# EAGLE design Gate to Trig Converter V1 (EAGLE 7.7.0)
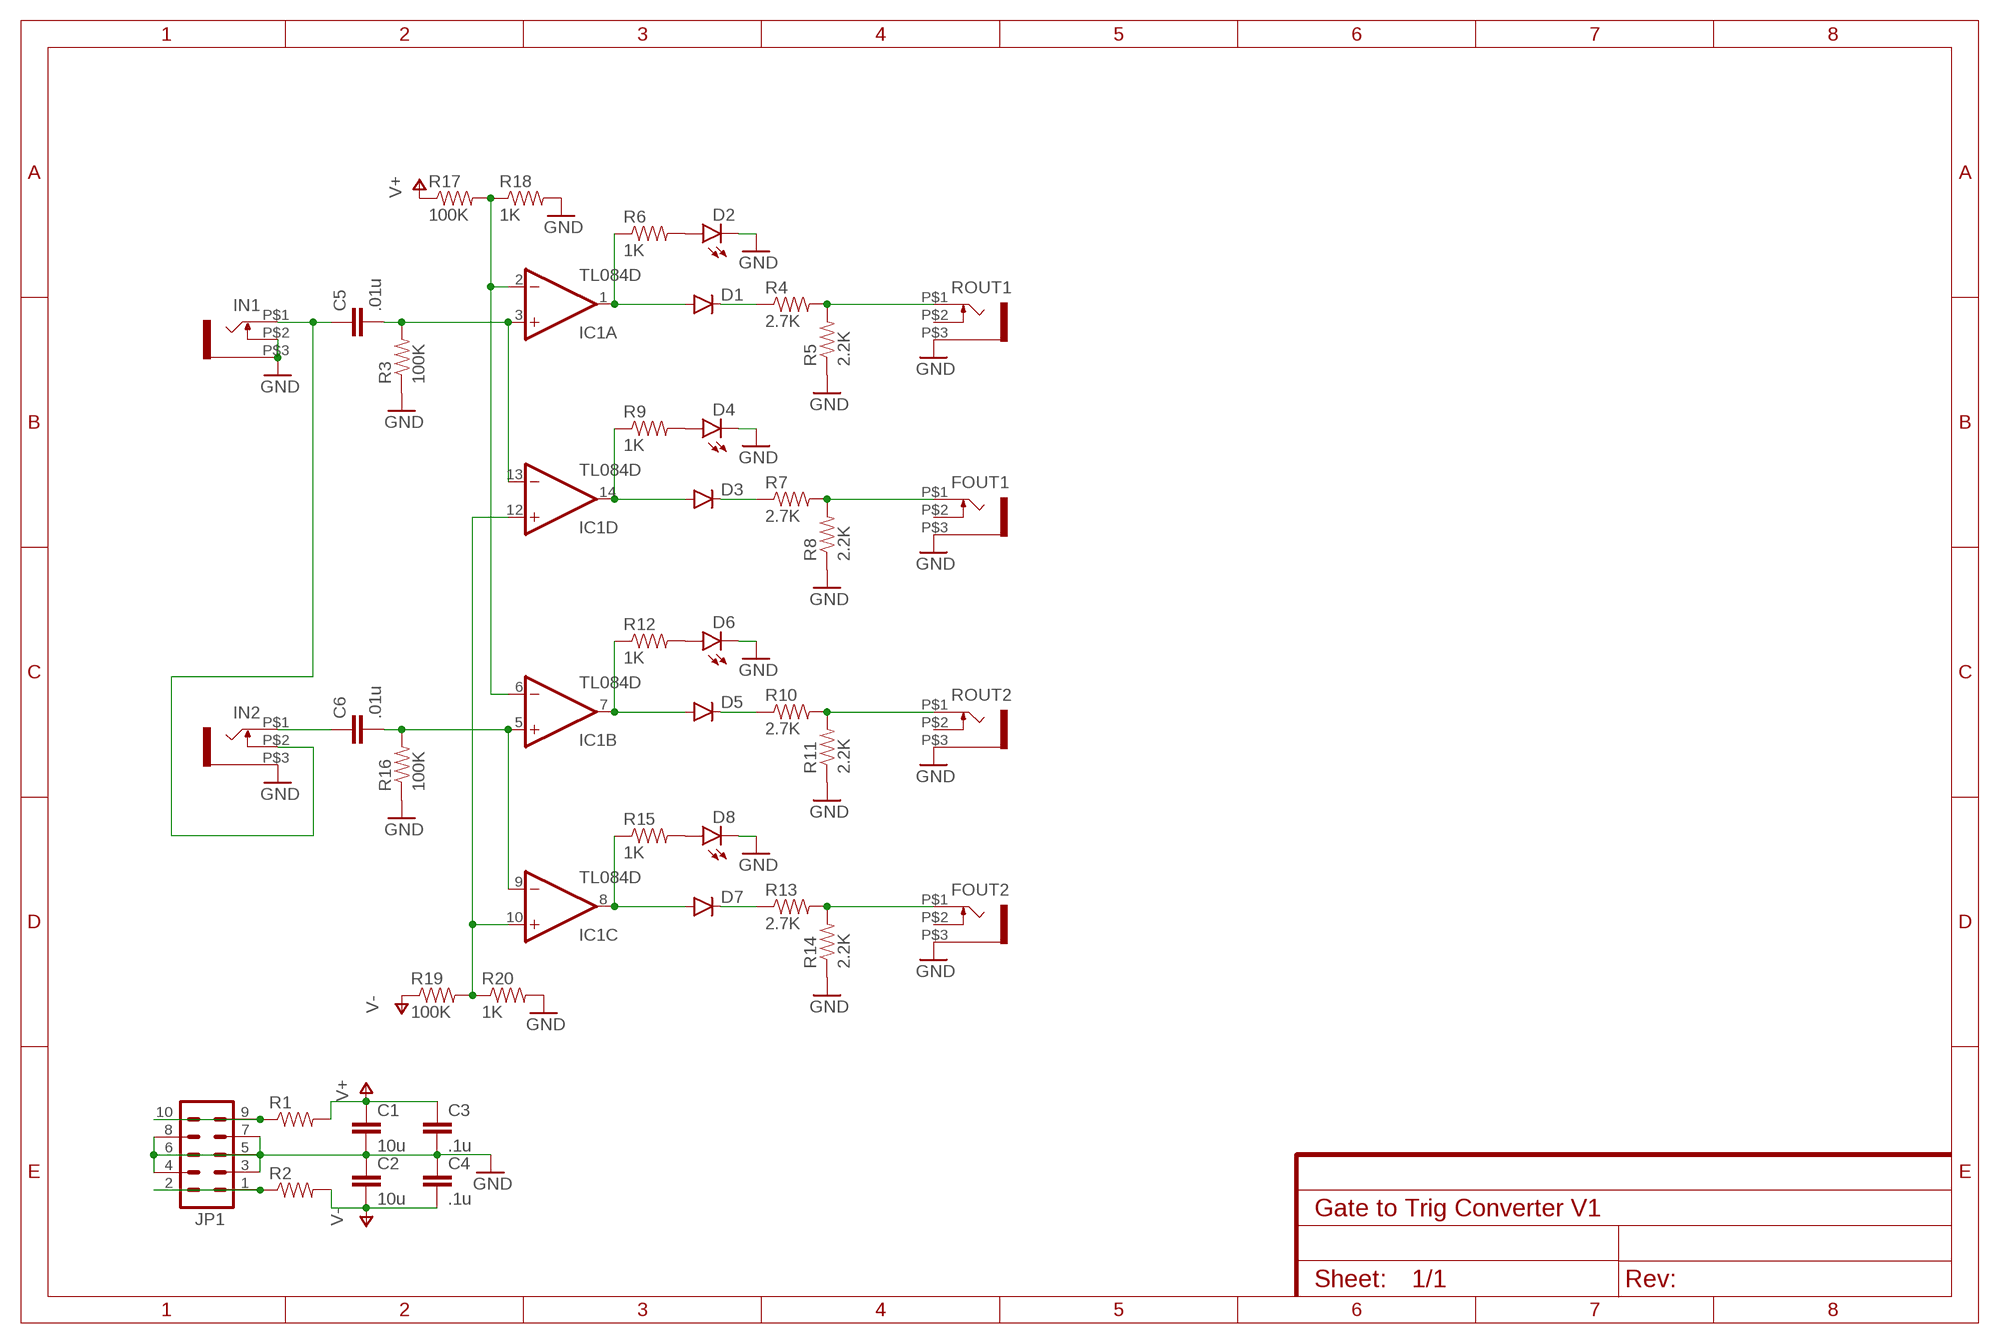
[diagram p0: schematic, sheet 1]

## Parts
C1  10u  CAP1206  [1206]
C2  10u  CAP1206  [1206]
C3  .1u  CAP0805  [0805]
C4  .1u  CAP0805  [0805]
C5  .01u  CAP0805  [0805]
C6  .01u  CAP0805  [0805]
D1  DIODESOD123  [SOD-123]
D2  LED3MM  [LED3MM]
D3  DIODESOD123  [SOD-123]
D4  LED3MM  [LED3MM]
D5  DIODESOD123  [SOD-123]
D6  LED3MM  [LED3MM]
D7  DIODESOD123  [SOD-123]
D8  LED3MM  [LED3MM]
FOUT1  WQP-PJ301M-12_JACK  [WQP-PJ301M-12_JACK]
FOUT2  WQP-PJ301M-12_JACK  [WQP-PJ301M-12_JACK]
IC1  TL084D  [SO14]
IN1  WQP-PJ301M-12_JACK  [WQP-PJ301M-12_JACK]
IN2  WQP-PJ301M-12_JACK  [WQP-PJ301M-12_JACK]
JP1  M05X2PTH  [AVR_ICSP]
R1  RESISTOR0805-RES  [0805]
R2  RESISTOR0805-RES  [0805]
R3  100K  RESISTOR0805-RES  [0805]
R4  2.7K  RESISTOR0805-RES  [0805]
R5  2.2K  RESISTOR0805-RES  [0805]
R6  1K  RESISTOR0805-RES  [0805]
R7  2.7K  RESISTOR0805-RES  [0805]
R8  2.2K  RESISTOR0805-RES  [0805]
R9  1K  RESISTOR0805-RES  [0805]
R10  2.7K  RESISTOR0805-RES  [0805]
R11  2.2K  RESISTOR0805-RES  [0805]
R12  1K  RESISTOR0805-RES  [0805]
R13  2.7K  RESISTOR0805-RES  [0805]
R14  2.2K  RESISTOR0805-RES  [0805]
R15  1K  RESISTOR0805-RES  [0805]
R16  100K  RESISTOR0805-RES  [0805]
R17  100K  RESISTOR0805-RES  [0805]
R18  1K  RESISTOR0805-RES  [0805]
R19  100K  RESISTOR0805-RES  [0805]
R20  1K  RESISTOR0805-RES  [0805]
ROUT1  WQP-PJ301M-12_JACK  [WQP-PJ301M-12_JACK]
ROUT2  WQP-PJ301M-12_JACK  [WQP-PJ301M-12_JACK]

## Nets
GND: C1.2 C2.1 C3.2 C4.1 D2.K(C) D4.K(C) D6.K(C) D8.K(C) FOUT1.P$3 FOUT2.P$3 IN1.P$2 IN1.P$3 IN2.P$3 JP1.3 JP1.4 JP1.5 JP1.6 JP1.7 JP1.8 R3.1 R5.1 R8.1 R11.1 R14.1 R16.1 R18.2 R20.2 ROUT1.P$3 ROUT2.P$3
N$1: JP1.9 JP1.10 R1.1
N$2: JP1.1 JP1.2 R2.1
N$5: R4.2 R5.2 ROUT1.P$1
N$6: D2.A R6.2
N$7: C5.1 IN1.P$1 IN2.P$2
N$8: C5.2 IC1.3(A:+IN) IC1.13(D:-IN) R3.2
N$9: D1.A IC1.1(A:OUT) R6.1
N$10: D1.C R4.1
N$11: FOUT1.P$1 R7.2 R8.2
N$12: D4.A R9.2
N$13: D3.A IC1.14(D:OUT) R9.1
N$14: D3.C R7.1
N$15: R10.2 R11.2 ROUT2.P$1
N$16: D6.A R12.2
N$17: D5.A IC1.7(B:OUT) R12.1
N$18: D5.C R10.1
N$19: FOUT2.P$1 R13.2 R14.2
N$20: D8.A R15.2
N$21: D7.A IC1.8(C:OUT) R15.1
N$22: D7.C R13.1
N$23: C6.1 IN2.P$1
N$24: C6.2 IC1.5(B:+IN) IC1.9(C:-IN) R16.2
N$25: IC1.2(A:-IN) IC1.6(B:-IN) R17.2 R18.1
N$26: IC1.10(C:+IN) IC1.12(D:+IN) R19.2 R20.1
V+: C1.1 C3.1 R1.2 R17.1
V-: C2.2 C4.2 R2.2 R19.1
Unconnected: FOUT1.P$2 FOUT2.P$2 ROUT1.P$2 ROUT2.P$2

## Power pins joined to a net without a drawn wire
V+: IC1.4(P:V+)
V-: IC1.11(P:V-)

## Library data of the parts
C1-C6 = SparkFun-Passives:CAP: Capacitor Standard 0603 ceramic capacitor, and 0.1" leaded capacitor.
D1 D3 D5 D7 = SparkFun-DiscreteSemi:DIODE: Diode These are standard reverse protection diodes and small signal diodes. SMA package can handle up to about 1A. SOD-323 can handle about 200mA. What the SOD-323 package when ordering, there are some mfgs out there that are 5-pin packages.
D2 D4 D6 D8 = SparkFun-LED:LED: LEDs Standard schematic elements and footprints for 5mm, 3mm, 1206, and 0603 sized LEDs. 5mm - Spark Fun Electronics SKU : COM-00529 (and others)
FOUT1 FOUT2 IN1 IN2 ROUT1 ROUT2 = thonkiconn:WQP-PJ301M-12_JACK
IC1 = linear:TL084: OP AMP
JP1 = SparkFun-Connectors:M05X2: Header 5x2 Standard 10-pin dual row 0.1" header. Commonly used with AVR-ISP. Use with Spark Fun Electronics SKU: PRT-00778
R1-R20 = SparkFun-Passives:RESISTOR: Resistor Basic schematic elements and footprints for 0603, 1206, and PTH resistors.

## Board
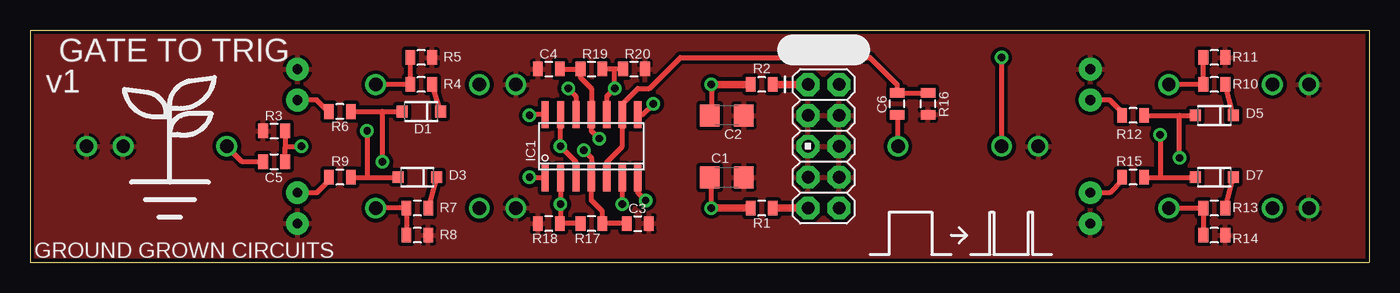
[diagram p1: board, top side]
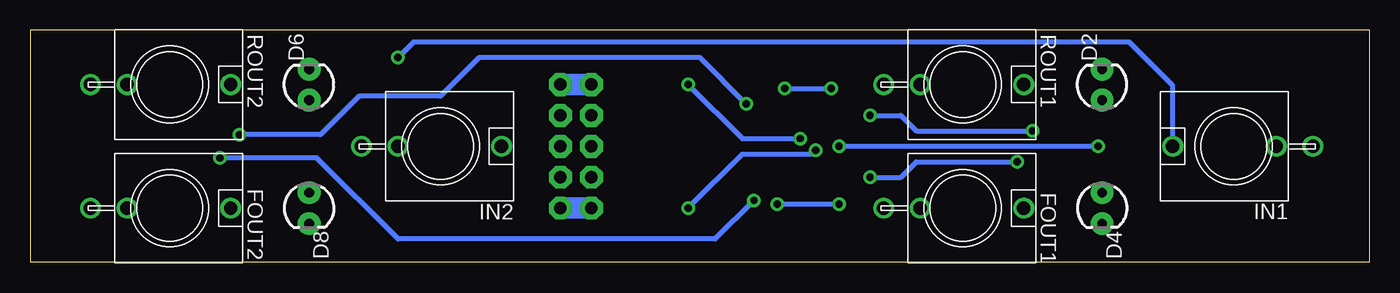
[diagram p2: board, bottom side, seen from below]

Size 109.86 x 19.05 mm. Coordinates in mm from the lower left corner, seen from the top.
Outline: 0,0 109.86,0 109.86,19.05 0,19.05 0,0
Copper layers (1*16): Top 0.035mm / dielectric 1.5mm / Bottom 0.035mm
Design rules "SparkFun": minimum track width 8mil, minimum drill 20mil, track to track 8mil, track to pad 8mil, pad to pad 8mil, via to via 8mil, smd to smd 8mil, copper to edge 8mil, drill to drill 8mil, minimum pad ring 12mil, minimum via ring 10mil, stop-mask expansion 4mil, vias tented up to drill 20mil, thermal gap 10mil

### Footprints (pad centres in the part's own frame; a part is rotated, then mirrored left to right if it is on the bottom)
1206 = smd 1.6 x 1.8: 1 -1.4,0; 2 1.4,0
0805 = smd 0.8 x 1.2: 1 -0.9,0; 2 0.9,0
SOD-123 = smd 0.9 x 0.95: A 1.575,0; C -1.575,0
LED3MM = drill 0.813 pad 1.88: A -1.27,0; K 1.27,0
WQP-PJ301M-12_JACK = drill 1.1: P$1 0,5; P$2 0,-3.5; P$3 0,-6.5
SO14 = smd 0.6 x 2.2: 1 -3.81,-2.6; 2 -2.54,-2.6; 3 -1.27,-2.6; 4 0,-2.6; 5 1.27,-2.6; 6 2.54,-2.6; 7 3.81,-2.6; 8 3.81,2.6; 9 2.54,2.6; 10 1.27,2.6; 11 0,2.6; 12 -1.27,2.6; 13 -2.54,2.6; 14 -3.81,2.6
AVR_ICSP = drill 1.016 pad 1.88 octagon: 1 -1.27,5.08; 2 1.27,5.08; 3 -1.27,2.54; 4 1.27,2.54; 5 -1.27,0; 6 1.27,0; 7 -1.27,-2.54; 8 1.27,-2.54; 9 -1.27,-5.08; 10 1.27,-5.08

### Placement (x,y rotation side)
C1  57.15,6.99 0 top
C2  57.15,12.06 180 top
C3  49.85,3.17 0 top
C4  42.55,15.88 0 top
C5  20,8.26 0 top
C6  71.12,13.02 90 top
D1  32.07,12.38 180 top
D2  21.91,14.61 90 bottom
D3  31.75,6.99 180 top
D4  21.91,4.45 270 bottom
D5  97.16,12.06 180 top
D6  87,14.61 90 bottom
D7  97.16,6.99 180 top
D8  87,4.45 270 bottom
FOUT1  33.34,4.45 270 bottom
FOUT2  98.42,4.45 270 bottom
IC1  46.04,9.53 0 top
IN1  11.11,9.53 90 bottom
IN2  76.2,9.53 270 bottom
JP1  65.09,9.53 0 top
R1  60.01,4.45 180 top
R2  60.01,14.61 180 top
R3  20,10.79 0 top
R4  32.07,14.61 180 top
R5  32.07,16.83 180 top
R6  25.4,12.38 180 top
R7  31.75,4.45 180 top
R8  31.75,2.22 180 top
R9  25.4,6.99 180 top
R10  97.16,14.61 180 top
R11  97.16,16.83 180 top
R12  90.49,12.06 180 top
R13  97.16,4.45 180 top
R14  97.16,2.22 180 top
R15  90.49,6.99 180 top
R16  73.66,13.02 90 top
R17  46.04,3.17 180 top
R18  42.55,3.17 180 top
R19  46.04,15.88 0 top
R20  49.53,15.88 0 top
ROUT1  33.34,14.61 270 bottom
ROUT2  98.42,14.61 270 bottom
U$1  [LOGO_MED]  11.43,6.67 0 top

### Tracks (layer width: path | path; a pad name or v marks a point on that pad's centre or on a via)
GND
  pour Top (isolate 0.305): 0,0 0,19.05 109.86,19.05 109.86,0
N$1
  Top 0.61: R1.1 JP1.9
  Bottom 1.778: JP1.10 JP1.9
N$2
  Top 0.61: R2.1 JP1.1
  Bottom 1.778: JP1.2 JP1.1
N$5
  Top 0.406: R5.2 R4.2 ROUT1.P$1
N$6
  Top 0.406: R6.2 24.45,12.38 23.5,13.34 D2.A
N$7  (via drill 0.6)
  Top 0.406: v79.69,16.83 IN2.P$2 | C5.1 17.38,8.26 IN1.P$1
  Bottom 0.406: IN1.P$1 16.11,14.53 19.68,18.1 78.42,18.1 v79.69,16.83
N$8  (via drill 0.6)
  Top 0.406: IC1.3 44.77,8.26 v43.5,9.53 IC1.13 | C5.2 20.9,9.47 20.95,9.53 | 20.95,9.53 v22.23,9.53 | R3.2 20.9,9.58 20.95,9.53
  Bottom 0.406: v22.23,9.53 v43.5,9.53
N$9  (via drill 0.6)
  Top 0.406: IC1.1 41.02,6.92 v40.96,6.99 | v28.89,8.26 28.89,12.38 | 28.89,12.38 D1.A | R6.1 28.89,12.38
  Bottom 0.406: v40.96,6.99 38.42,6.99 37.15,8.26 v28.89,8.26
N$10
  Top 0.406: D1.C R4.1
N$11
  Top 0.406: R8.2 R7.2 FOUT1.P$1
N$12
  Top 0.406: R9.2 24.5,6.72 23.5,5.71 D4.A
N$13  (via drill 0.6)
  Top 0.406: IC1.14 41.02,12.12 v40.96,12.06 | v27.62,10.79 27.62,6.99 | 27.62,6.99 D3.A | R9.1 27.62,6.99
  Bottom 0.406: v40.96,12.06 38.42,12.06 37.15,10.79 v27.62,10.79
N$14
  Top 0.406: D3.C R7.1
N$15
  Top 0.406: R11.2 R10.2 ROUT2.P$1
N$16
  Top 0.406: R12.2 89.59,12.33 88.58,13.34 D6.A
N$17  (via drill 0.6)
  Top 0.406: IC1.7 49.85,5.71 v50.48,5.08 | v94.3,8.57 94.3,12.06 | 94.3,12.06 D5.A | R12.1 94.3,12.06
  Bottom 0.406: v50.48,5.08 53.66,1.91 79.69,1.91 86.36,8.57 v94.3,8.57
N$18
  Top 0.406: D5.C R10.1
N$19
  Top 0.406: FOUT2.P$1 R13.2 R14.2
N$20
  Top 0.406: R15.2 89.59,6.72 88.58,5.71 D8.A
N$21  (via drill 0.6)
  Top 0.406: IC1.8 50.23,12.12 v51.12,13.02 | v92.71,10.48 92.71,6.99 | R15.1 92.71,6.99 | 92.71,6.99 D7.A
  Bottom 0.406: v51.12,13.02 54.93,16.83 73.03,16.83 76.2,13.65 82.87,13.65 86.04,10.48 v92.71,10.48
N$22
  Top 0.406: R13.1 D7.C
N$23
  Top 0.406: IN2.P$1 71.2,12.04 C6.1
N$24
  Top 0.406: IC1.5 47.31,8.26 48.58,9.53 IC1.9 48.58,13.02 49.85,14.29 50.8,14.29 53.34,16.83 68.9,16.83 71.12,14.61 C6.2 R16.2
N$25  (via drill 0.6)
  Top 0.406: IC1.2 v43.5,4.76 43.5,3.23 R18.1 R17.2 | v48.58,4.76 IC1.6
  Bottom 0.406: v43.5,4.76 v48.58,4.76
N$26  (via drill 0.6)
  Top 0.406: v44.13,14.29 44.77,13.65 IC1.12 | IC1.10 47.31,13.65 v47.94,14.29 47.94,15.88 | R20.1 47.94,15.88 | 47.94,15.88 R19.2
  Bottom 0.406: v47.94,14.29 v44.13,14.29
V+  (via drill 0.6)
  Top 0.406: v45.4,9.21 46.04,8.57 IC1.4 46.04,5.08 46.94,4.18 R17.1 C3.1 | v55.88,4.45 55.88,6.86 C1.1
  Top 0.61: R1.2 v55.88,4.45
  Bottom 0.406: v55.88,4.45 51.44,8.89 45.72,8.89 v45.4,9.21
V-  (via drill 0.6)
  Top 0.406: v46.67,10.16 46.04,10.79 IC1.11 46.04,14.29 45.14,15.19 R19.1 C4.2 | v55.88,14.61 55.88,12.2 C2.2
  Top 0.61: R2.2 v55.88,14.61
  Bottom 0.406: v55.88,14.61 51.44,10.16 v46.67,10.16

### Text on the board
tPlace: GATE TO TRIG | v1 | GROUND GROWN CIRCUITS